# Altium schematic sheet CAN Transceiver SN65HVD232D Angle Connector.SchDoc
size A4; Author: Wojciech Grędel; CompanyName: AGH Racing; DocumentNumber: 11; Revision: 3; SheetNumber: 1; SheetTotal: 1; CarNumber: 6; ProjectName: Project Name
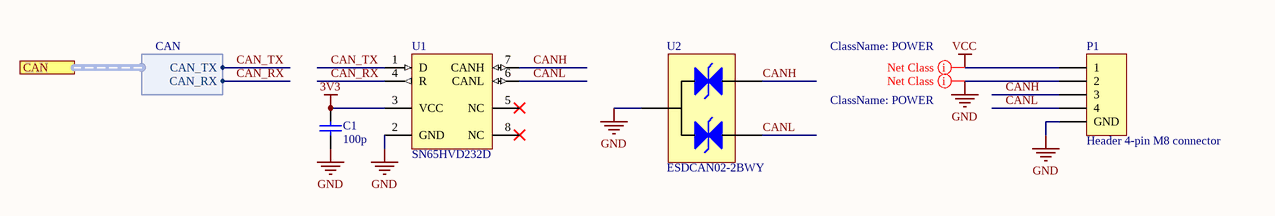
[diagram p0: CAN Transceiver SN65HVD232D Angle Connector.SchDoc]

## Parts
C1  value 100p  [CAP_0603_IPC_MD]  (hidden comment: Cap)
P1  Header 4-pin M8 connector  [M8S-04PMMR-SF8001]
U1  SN65HVD232D  [SOIC_8_IPC_MD]
U2  ESDCAN02-2BWY  [SOT23_IPC_MD]

## Ports
CAN (harness CAN)

## Harnesses
CAN: CAN_TX, CAN_RX

## Nets
3V3: C1.2 U1.3(VCC)
GND: C1.1 P1.2 P1.GND U1.2(GND) U2.3(COM)
VCC: P1.1
CAN_RX: U1.4(R) ; port CAN.CAN_RX
CAN_TX: U1.1(D) ; port CAN.CAN_TX
CANH: P1.3 U1.7(CANH) U2.1(IN1)
CANL: P1.4 U1.6(CANL) U2.2(IN2)

Not connected (* = marked no-connect by the designer): U1 5(NC)* 8(NC)*

## Layout directives
net class POWER: GND, VCC

## Notes on the sheet
- Confidential / Not for distribution !
- Document name:
- Designer Name:
- Date/Time:
- Revision:

## Library data of the parts
C1 = Cap: Capacitor
P1 = Header 4-pin M8 connector: Header, 4-pin M8 connector
U1 = SN65HVD232D: 3.3V CAN Transceiver with Standby Mode, 17 mA, -40 to 85 degC, 8-pin SOIC (D), Green (RoHS & no Sb/Br)
U2 = ESDCAN02-2BWY: ESD CAN protection (2 transils)